# EAGLE design Daughter Board (EAGLE 9.1.3)
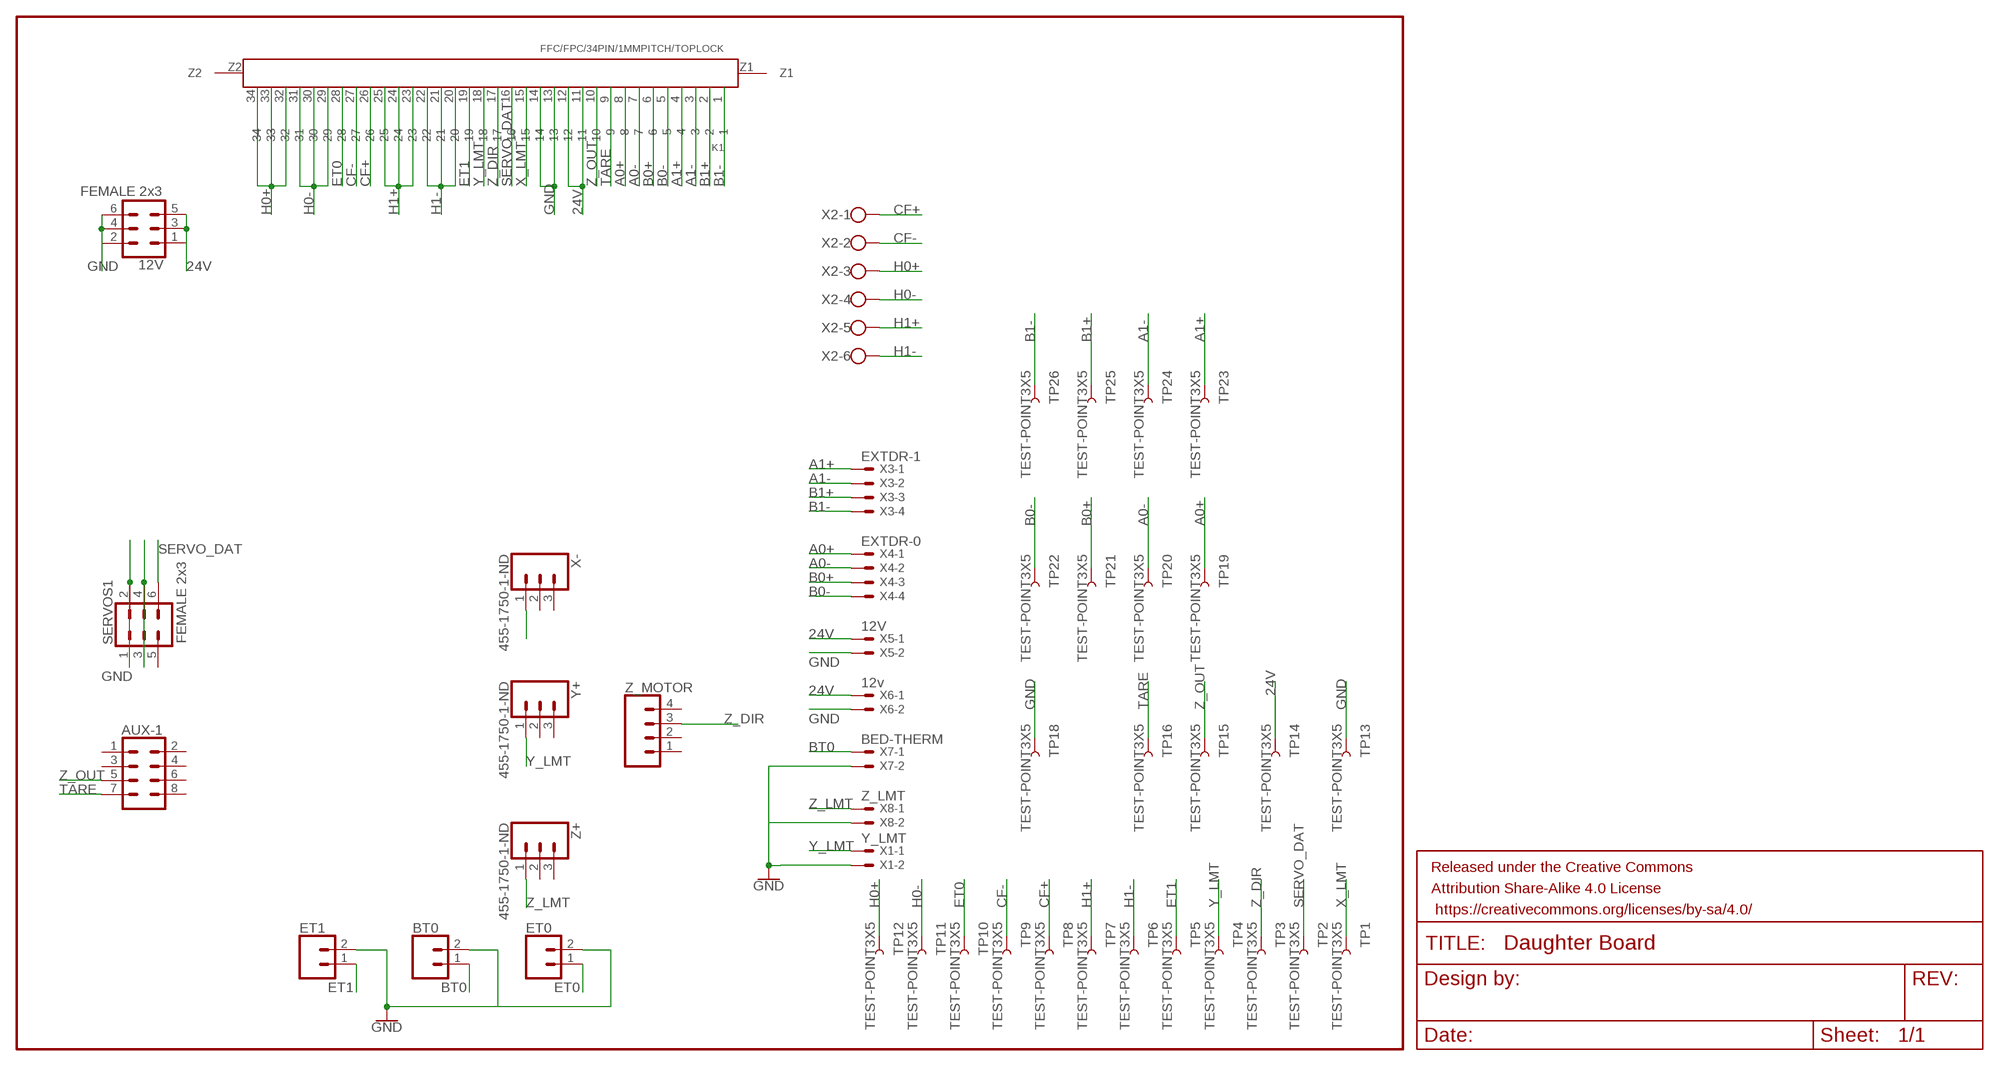
[diagram p0: schematic, sheet 1]

## Parts
12V  FEMALE 2x3  CONN_03X2FEMALE  [2X3]
AUX-1  CONN_04X2  [2X4]
BT0  CONN_02  [1X02]
ET0  CONN_02  [1X02]
ET1  CONN_02  [1X02]
FRAME1  FRAME-LETTERNO_PACKAGE  [DUMMY]
K1  FFC/FPC/34PIN/1MMPITCH/TOPLOCK  [34PIN/1MMPITCH/FFC/FPC]
SERVOS1  FEMALE 2x3  CONN_03X2FEMALE  [2X3]
TP1  TEST-POINT3X5  [PAD.03X.05]
TP2  TEST-POINT3X5  [PAD.03X.05]
TP3  TEST-POINT3X5  [PAD.03X.05]
TP4  TEST-POINT3X5  [PAD.03X.05]
TP5  TEST-POINT3X5  [PAD.03X.05]
TP6  TEST-POINT3X5  [PAD.03X.05]
TP7  TEST-POINT3X5  [PAD.03X.05]
TP8  TEST-POINT3X5  [PAD.03X.05]
TP9  TEST-POINT3X5  [PAD.03X.05]
TP10  TEST-POINT3X5  [PAD.03X.05]
TP11  TEST-POINT3X5  [PAD.03X.05]
TP12  TEST-POINT3X5  [PAD.03X.05]
TP13  TEST-POINT3X5  [PAD.03X.05]
TP14  TEST-POINT3X5  [PAD.03X.05]
TP15  TEST-POINT3X5  [PAD.03X.05]
TP16  TEST-POINT3X5  [PAD.03X.05]
TP18  TEST-POINT3X5  [PAD.03X.05]
TP19  TEST-POINT3X5  [PAD.03X.05]
TP20  TEST-POINT3X5  [PAD.03X.05]
TP21  TEST-POINT3X5  [PAD.03X.05]
TP22  TEST-POINT3X5  [PAD.03X.05]
TP23  TEST-POINT3X5  [PAD.03X.05]
TP24  TEST-POINT3X5  [PAD.03X.05]
TP25  TEST-POINT3X5  [PAD.03X.05]
TP26  TEST-POINT3X5  [PAD.03X.05]
X1  Y_LMT  JST-XH-02-PIN-LONG-PAD  [JST-XH-02-PACKAGE-LONG-PAD]
X2  W237-6  [W237-6]
X3  EXTDR-1  JST-XH-04-PIN-LONG-PAD  [JST-XH-04-PACKAGE-LONG-PAD]
X4  EXTDR-0  JST-XH-04-PIN-LONG-PAD  [JST-XH-04-PACKAGE-LONG-PAD]
X5  12V  JST-XH-02-PIN-LONG-PAD  [JST-XH-02-PACKAGE-LONG-PAD]
X6  12v  JST-XH-02-PIN-LONG-PAD  [JST-XH-02-PACKAGE-LONG-PAD]
X7  BED-THERM  JST-XH-02-PIN-LONG-PAD  [JST-XH-02-PACKAGE-LONG-PAD]
X8  Z_LMT  JST-XH-02-PIN-LONG-PAD  [JST-XH-02-PACKAGE-LONG-PAD]
X-  455-1750-1-ND  CONN_03  [1X03]
Y+  455-1750-1-ND  CONN_03  [1X03]
Z+  455-1750-1-ND  CONN_03  [1X03]
Z_MOTOR  CONN_04  [1X04]

## Nets
24V: 12V.1 12V.3 12V.5 K1.11 K1.12 TP14.P$1 X5.1 X6.1
A0+: K1.8 TP19.P$1 X4.1
A0-: K1.7 TP20.P$1 X4.2
A1+: K1.4 TP23.P$1 X3.1
A1-: K1.3 TP24.P$1 X3.2
B0+: K1.6 TP21.P$1 X4.3
B0-: K1.5 TP22.P$1 X4.4
B1+: K1.2 TP25.P$1 X3.3
B1-: K1.1 TP26.P$1 X3.4
BT0: BT0.1 X7.1
CF+: K1.26 TP8.P$1 X2.1
CF-: K1.27 TP9.P$1 X2.2
ET0: ET0.1 K1.28 TP10.P$1
ET1: ET1.1 K1.19 TP5.P$1
GND: 12V.2 12V.4 12V.6 BT0.2 ET0.2 ET1.2 K1.13 K1.14 SERVOS1.1 SERVOS1.2 TP13.P$1 TP18.P$1 X1.2 X5.2 X6.2 X7.2 X8.2
H0+: K1.32 K1.33 K1.34 TP12.P$1 X2.3
H0-: K1.29 K1.30 K1.31 TP11.P$1 X2.4
H1+: K1.23 K1.24 K1.25 TP7.P$1 X2.5
H1-: K1.20 K1.21 K1.22 TP6.P$1 X2.6
N$5: SERVOS1.3 SERVOS1.4
SERVO_DAT: K1.16 SERVOS1.6 TP2.P$1
TARE: AUX-1.7 K1.9 TP16.P$1
X_LMT: K1.15 TP1.P$1 X-.1
Y_LMT: K1.18 TP4.P$1 X1.1 Y+.1
Z_DIR: K1.17 TP3.P$1 Z_MOTOR.3
Z_LMT: X8.1 Z+.1
Z_OUT: AUX-1.5 K1.10 TP15.P$1
Unconnected: AUX-1.1 AUX-1.2 AUX-1.3 AUX-1.4 AUX-1.6 AUX-1.8 K1.Z1 K1.Z2 SERVOS1.5 X-.2 X-.3 Y+.2 Y+.3 Z+.2 Z+.3 Z_MOTOR.1 Z_MOTOR.2 Z_MOTOR.4

## Library data of the parts
12V SERVOS1 = SparkFun-Connectors:CONN_03X2: Multi connection point. Often used as Generic Header-pin footprint for 0.1 inch spaced/style header connections You can populate with any combo of single row headers, but if you'd like an exact match, check these: Header - 2x3 (Male, 0.1") <https://www.sparkfun.com/products/12807> (PRT-12807) Header - 2x3 (Female, 0.1") <https://www.sparkfun.com/products/13010> (PRT-13010) 2x3 Pin Shrouded Header <https://www.sparkfun.com/products/10877> (PRT-10877) On any of the 0.1 inch spaced packages, you can populate with these: Break Away Headers - Straight <https://www.sparkfun.com/products/116> (PRT-00116) Break Away Male Headers - Right Angle <https://www.sparkfun.com/products/553> (PRT-00553) Female Headers <https://www.sparkfun.com/products/115> (PRT-00115) Break Away Headers - Machine Pin <https://www.sparkfun.com/products/117> (PRT-00117) Break Away Female Headers - Swiss Machine Pin <https://www.sparkfun.com/products/743> (PRT-00743) Special note: the shrouded connector mates well with our 3x2 ribbon cables: Ribbon Crimp Connector - 6-pin (2x3, Female) <https://www.sparkfun.com/products/10651> (PRT-10651) Ribbon Cable - 6 wire (15ft) <https://www.sparkfun.com/products/10646> (PRT-10646); PROD_ID: CONN-11566
AUX-1 = SparkFun-Connectors:CONN_04X2: Multi connection point. Often used as Generic Header-pin footprint for 0.1 inch spaced/style header connections On any of the 0.1 inch spaced packages, you can populate with these: Break Away Headers - Straight <https://www.sparkfun.com/products/116> (PRT-00116) Break Away Male Headers - Right Angle <https://www.sparkfun.com/products/553> (PRT-00553) Female Headers <https://www.sparkfun.com/products/115> (PRT-00115) Break Away Headers - Machine Pin <https://www.sparkfun.com/products/117> (PRT-00117) Break Away Female Headers - Swiss Machine Pin <https://www.sparkfun.com/products/743> (PRT-00743)
BT0 ET0 ET1 = SparkFun-Connectors:CONN_02: Multi connection point. Often used as Generic Header-pin footprint for 0.1 inch spaced/style header connections On any of the 0.1 inch spaced packages, you can populate with these: Break Away Headers - Straight <https://www.sparkfun.com/products/116> (PRT-00116) Break Away Male Headers - Right Angle <https://www.sparkfun.com/products/553> (PRT-00553) Female Headers <https://www.sparkfun.com/products/115> (PRT-00115) Break Away Headers - Machine Pin <https://www.sparkfun.com/products/117> (PRT-00117) Break Away Female Headers - Swiss Machine Pin <https://www.sparkfun.com/products/743> (PRT-00743) For SCREWTERMINALS and SPRING TERMINALS visit here: Screw Terimnals on SparkFun.com <https://www.sparkfun.com/search/results?term=Screw+Terminals> (5mm/3.5mm/2.54mm spacing) This device is also useful as a general connection point to wire up your design to another part of your project. Our various solder wires solder well into these plated through hole pads. Hook-Up Wire - Assortment (Stranded, 22 AWG) <https://www.sparkfun.com/products/11375> (PRT-11375) Hook-Up Wire - Assortment (Solid Core, 22 AWG) <https://www.sparkfun.com/products/11367> (PRT-11367) View the entire wire category on our website here <https://www.sparkfun.com/categories/141> Special notes: Molex polarized connector foot print use with: PRT-08233 with associated crimp pins and housings. 2.54_SCREWTERM for use with PRT-10571. 3.5mm Screw Terminal footprints for PRT-08084 5mm Screw Terminal footprints for use with PRT-08432
FRAME1 = SparkFun-Aesthetics:FRAME-LETTER: Schematic Frame - Letter Standard 8.5x11 US Letter frame; DESIGNER: Nobody; VERSION: v01
K1 = FracktalWorks_Eagle_Library:FFC/FPC/34PIN/1MMPITCH/TOPLOCK
TP1-TP16 TP18-TP26 = SparkFun-Connectors:TEST-POINT: SparkFun Test Points Bare copper test points for troubleshooting or In-Circuit-Testing. These are used by our Production team for verifying production board runs using pogo-pins on test beds. SparkFun Products: SparkFun LSM9DS1 Breakout <https://www.sparkfun.com/products/13284> SparkFun PSOC <https://www.sparkfun.com/products/13714> SparkFun Load Cell Amplifier <https://www.sparkfun.com/products/13879>
X1 X5-X8 = Rembrandt Electronics - JST XH Connectors v1-0:JST-XH-02-PIN: JST XH Connector 2 Pin Wire to board connector. Pitch: 2,54 mm, (0.100") Number of pins: 2 Created by Rembrandt Electronics www.rembrandtelectronics.com
X2 = con-wago-500:W237-6: WAGO SCREW CLAMP; OC_FARNELL: unknown; OC_NEWARK: unknown
X3 X4 = Rembrandt Electronics - JST XH Connectors v1-0:JST-XH-04-PIN: JST XH Connector 2 Pin Wire to board connector. Pitch: 2,54 mm, (0.100") Number of pins: 4 Created by Rembrandt Electronics www.rembrandtelectronics.com
X- Y+ Z+ = SparkFun-Connectors:CONN_03: Multi connection point. Often used as Generic Header-pin footprint for 0.1 inch spaced/style header connections On any of the 0.1 inch spaced packages, you can populate with these: Break Away Headers - Straight <https://www.sparkfun.com/products/116> (PRT-00116) Break Away Male Headers - Right Angle <https://www.sparkfun.com/products/553> (PRT-00553) Female Headers <https://www.sparkfun.com/products/115> (PRT-00115) Break Away Headers - Machine Pin <https://www.sparkfun.com/products/117> (PRT-00117) Break Away Female Headers - Swiss Machine Pin <https://www.sparkfun.com/products/743> (PRT-00743) Stackable Header - 3 Pin (Female, 0.1") <https://www.sparkfun.com/products/13875> (PRT-13875) For SCREWTERMINALS and SPRING TERMINALS visit here: Screw Terimnals on SparkFun.com <https://www.sparkfun.com/search/results?term=Screw+Terminals> (5mm/3.5mm/2.54mm spacing) This device is also useful as a general connection point to wire up your design to another part of your project. Our various solder wires solder well into these plated through hole pads. Hook-Up Wire - Assortment (Stranded, 22 AWG) <https://www.sparkfun.com/products/11375> (PRT-11375) Hook-Up Wire - Assortment (Solid Core, 22 AWG) <https://www.sparkfun.com/products/11367> (PRT-11367) View the entire wire category on our website here <https://www.sparkfun.com/categories/141> Special notes: Molex polarized connector foot print use with SKU : PRT-08232 with associated crimp pins and housings.; PROD_ID: XXX-00000
Z_MOTOR = SparkFun-Connectors:CONN_04: Multi connection point. Often used as Generic Header-pin footprint for 0.1 inch spaced/style header connections On any of the 0.1 inch spaced packages, you can populate with these: Break Away Headers - Straight <https://www.sparkfun.com/products/116> (PRT-00116) Break Away Male Headers - Right Angle <https://www.sparkfun.com/products/553> (PRT-00553) Female Headers <https://www.sparkfun.com/products/115> (PRT-00115) Break Away Headers - Machine Pin <https://www.sparkfun.com/products/117> (PRT-00117) Break Away Female Headers - Swiss Machine Pin <https://www.sparkfun.com/products/743> (PRT-00743) For SCREWTERMINALS and SPRING TERMINALS visit here: Screw Terimnals on SparkFun.com <https://www.sparkfun.com/search/results?term=Screw+Terminals> (5mm/3.5mm/2.54mm spacing) This device is also useful as a general connection point to wire up your design to another part of your project. Our various solder wires solder well into these plated through hole pads. Hook-Up Wire - Assortment (Stranded, 22 AWG) <https://www.sparkfun.com/products/11375> (PRT-11375) Hook-Up Wire - Assortment (Solid Core, 22 AWG) <https://www.sparkfun.com/products/11367> (PRT-11367) View the entire wire category on our website here <https://www.sparkfun.com/categories/141> Special notes: Molex polarized connector foot print use with SKU : PRT-08231 with associated crimp pins and housings. 1MM SMD Version SKU: PRT-10208; PROD_ID: CONN-09696

## Board
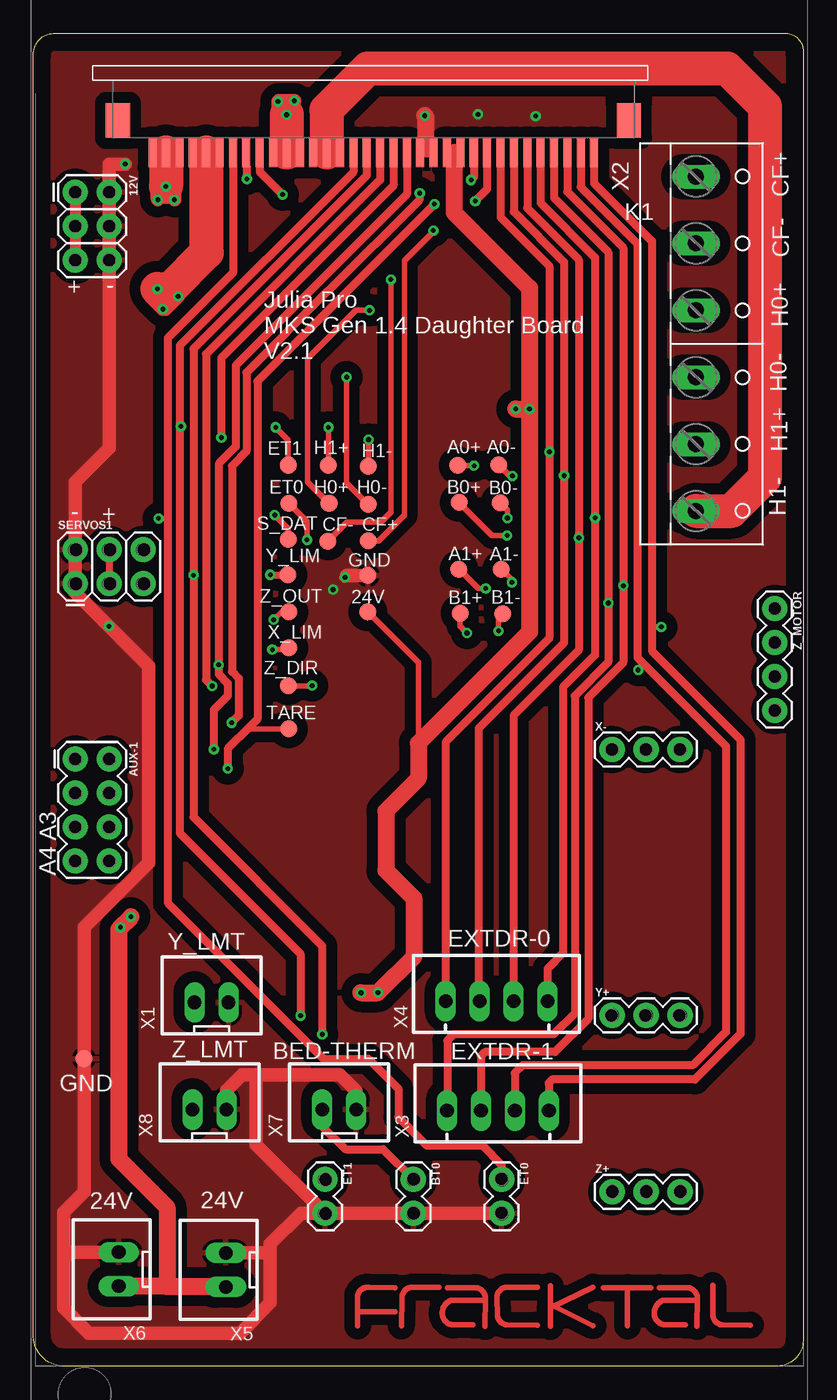
[diagram p1: board, top side]
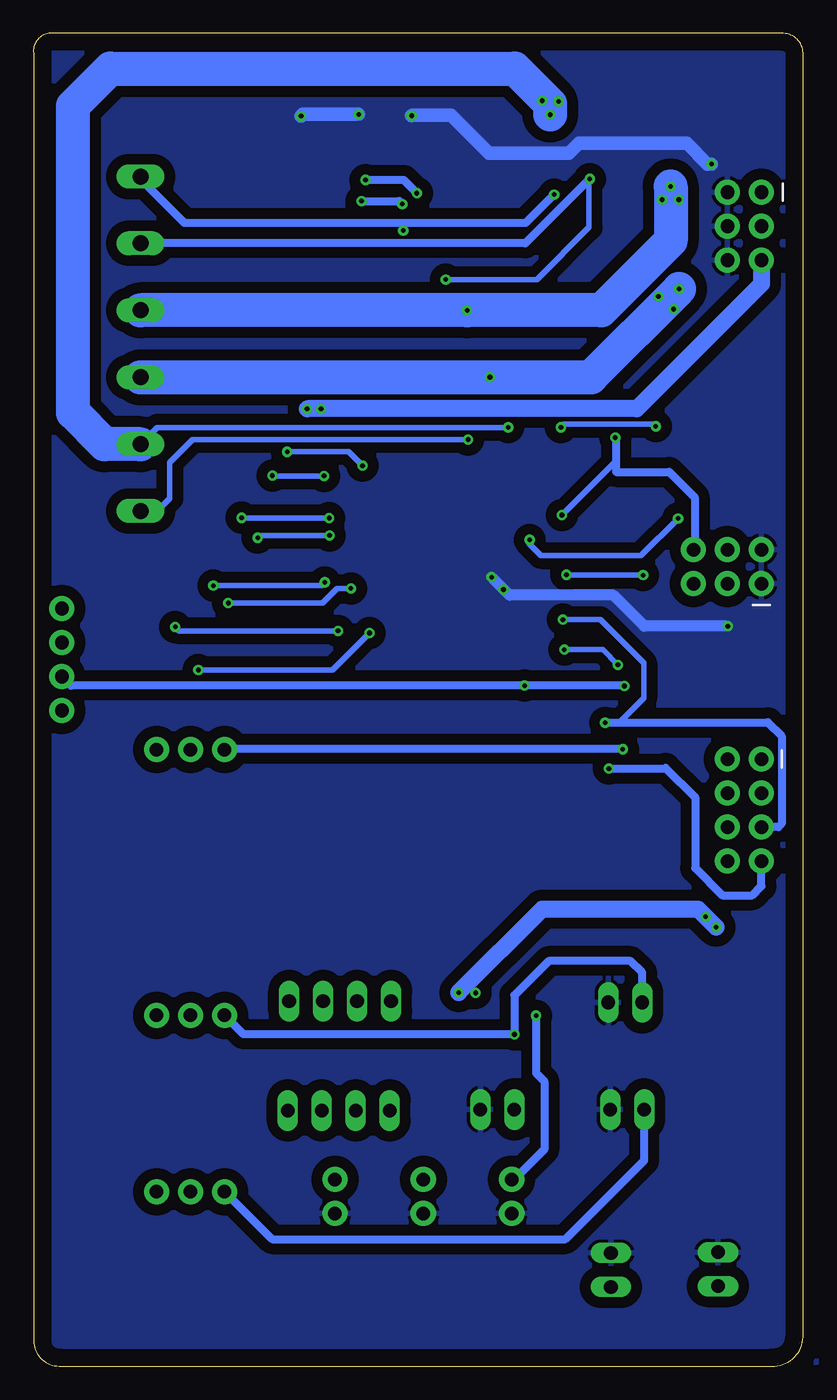
[diagram p2: board, bottom side, seen from below]

Size 57.54 x 99.59 mm. Coordinates in mm from the lower left corner, seen from the top.
Outline: 57.53,98.12 57.53,1.9 arc-90 55.63,0 2.34,0 arc-90 0,2.18 0,97.99 arc-90 1.47,99.59 56.39,99.59 arc-90 57.53,98.12
Copper layers (1*16): Top 0.035mm / dielectric 1.5mm / Bottom 0.035mm
Design rules "LionCircuits": minimum track width 8mil, minimum drill 0.35mm, track to track 8mil, track to pad 8mil, pad to pad 8mil, via to via 8mil, smd to smd 8mil, copper to edge 50mil, drill to drill 10mil, minimum pad ring 10mil, minimum via ring 8mil, stop-mask expansion 4mil, vias tented up to drill 0mil, thermal gap 10mil

### Footprints (pad centres in the part's own frame; a part is rotated, then mirrored left to right if it is on the bottom)
2X3 = drill 1.016 pad 1.88: 1 0,0; 2 0,2.54; 3 2.54,0; 4 2.54,2.54; 5 5.08,0; 6 5.08,2.54
2X4 = drill 1.016 pad 1.88: 1 -3.81,-1.27; 2 -3.81,1.27; 3 -1.27,-1.27; 4 -1.27,1.27; 5 1.27,-1.27; 6 1.27,1.27; 7 3.81,-1.27; 8 3.81,1.27
1X02 = drill 1.016 pad 1.88: 1 0,0; 2 2.54,0
34PIN/1MMPITCH/FFC/FPC = smd 0.6 x 2.2: 1 -14.43,2.1; 2 -13.43,2.1; 3 -12.43,2.1; 4 -11.43,2.1; 5 -10.43,2.1; 6 -9.43,2.1; 7 -8.43,2.1; 8 -7.43,2.1; 9 -6.43,2.1; 10 -5.43,2.1; 11 -4.43,2.1; 12 -3.43,2.1; 13 -2.43,2.1; 14 -1.43,2.1; 15 -0.43,2.1; 16 0.57,2.1; 17 1.57,2.1; 18 2.57,2.1; 19 3.57,2.1; 20 4.57,2.1; 21 5.57,2.1; 22 6.57,2.1; 23 7.57,2.1; 24 8.57,2.1; 25 9.57,2.1; 26 10.57,2.1; 27 11.57,2.1; 28 12.57,2.1; 29 13.57,2.1; 30 14.57,2.1; 31 15.57,2.1; 32 16.57,2.1; 33 17.57,2.1; 34 18.57,2.1 | smd 1.8 x 2.6: Z1 -17.03,-0.3; Z2 21.17,-0.3
PAD.03X.05 = smd 1.27 x 1.27: P$1 0,0
JST-XH-02-PACKAGE-LONG-PAD = drill 1.016 long: 1 -1.27,0; 2 1.27,0
W237-6 = drill 1.194 long: 1 -12.5,-1.27; 2 -7.5,-1.27; 3 -2.5,-1.27; 4 2.5,-1.27; 5 7.5,-1.27; 6 12.5,-1.27
JST-XH-04-PACKAGE-LONG-PAD = drill 1.016 long: 1 -3.81,0; 2 -1.27,0; 3 1.27,0; 4 3.81,0
1X03 = drill 1.016 pad 1.88: 1 0,0; 2 2.54,0; 3 5.08,0
1X04 = drill 1.016 pad 1.88: 1 0,0; 2 2.54,0; 3 5.08,0; 4 7.62,0

### Placement (x,y rotation side)
12V  3.12,87.73 270 top
AUX-1  4.39,41.55 270 top
BT0  28.4,13.94 270 top
ET0  35,13.94 270 top
ET1  21.79,13.94 270 top
FRAME1  30.81,190.86 270 top  (outside the outline)
K1  27.48,92.79 180 top
SERVOS1  3.12,58.47 0 top
TP1  19.1,53.67 0 top
TP2  19.05,61.8 0 top
TP3  19.05,50.83 0 top
TP4  19.02,59.13 0 top
TP5  19.05,67.34 0 top
TP6  25.04,67.26 0 top
TP7  22.05,67.31 0 top
TP8  25.02,61.67 0 top
TP9  22.02,61.65 0 top
TP10  19.08,64.49 0 top
TP11  25.02,64.39 0 top
TP12  22.1,64.47 0 top
TP13  3.78,22.96 180 top
TP14  24.99,56.36 180 top
TP15  19.1,56.36 180 top
TP16  19.08,47.62 180 top
TP18  24.99,59.08 180 top
TP19  31.72,67.31 180 top
TP20  34.77,67.36 180 top
TP21  31.83,64.54 180 top
TP22  34.87,64.52 180 top
TP23  31.8,59.56 0 top
TP24  34.98,59.54 0 top
TP25  31.9,56.26 0 top
TP26  35.08,56.24 0 top
U$1  [FRACKTALLOGO]  36.22,2.9 0 top
X1  13.31,27.18 0 top
X2  50.8,76.4 270 top
X3  34.72,19.1 0 top
X4  34.62,27.28 0 top
X5  14.38,7.19 90 top
X6  6.38,7.24 90 top
X7  22.86,19.18 0 top
X8  13.16,19.18 0 top
X-  43.26,46.08 0 top
Y+  43.26,26.21 0 top
Z+  43.26,13.03 0 top
Z_MOTOR  55.42,56.62 270 top

### Tracks (layer width: path | path; a pad name or v marks a point on that pad's centre or on a via)
24V  (via drill 0.35)
  Top 0.406: 28.78,46.56 28.78,52.58 TP14.P$1
  Top 0.508: K1.12 31.45,90.69 K1.11
  Top 0.813: 12V.1 12V.3 12V.5
  Top 1.27: v7.29,33.58 6.38,32.66 6.38,15.47 9.98,11.86 9.98,5.94 | v24.49,27.89 25.73,27.89 v25.76,27.91 28.43,30.59 28.43,34.96 26.34,37.06 26.34,41.48 28.78,43.92 28.78,46.56 37.08,54.86 v37.08,71.53 | 31.45,90.69 31.45,86.21 37.08,80.57 v37.08,71.53 | v36.04,71.53 v37.08,71.53 | 9.98,5.94 14.35,5.94 X5.1 | X6.1 6.4,5.94 9.98,5.94
  Bottom 1.27: 12V.5 3.12,80.87 12.45,71.55 37.06,71.55 v37.08,71.53 | v6.5,32.79 v7.29,33.58 7.87,34.16 19.51,34.16 v25.76,27.91
A0+  (via drill 0.35)
  Top 0.406: v32.94,67.28 31.75,67.28 TP19.P$1
  Top 0.61: X4.1 30.81,46.63 38.57,54.39 v38.57,68.33 38.57,82.2 34.91,85.86 K1.8
  Bottom 0.406: v32.94,67.28 33.99,68.33 v38.57,68.33
A0-  (via drill 0.35)
  Top 0.406: TP20.P$1 35.61,66.52 v35.81,66.52
  Top 0.61: X4.2 33.27,27.36 33.27,47.65 39.67,54.05 v39.67,66.55 39.67,82.51 35.91,86.27 K1.7
  Bottom 0.406: v35.81,66.52 36.37,66.52 39.65,66.52 v39.67,66.55
A1+  (via drill 0.35)
  Top 0.406: TP23.P$1 33.25,58.12 v33.81,58.12
  Top 0.61: X3.1 30.94,19.13 30.94,24.33 31.39,24.79 38.89,24.79 40.46,26.37 40.46,50.1 42.98,52.61 v42.98,57.02 42.98,83.24 38.91,87.31 K1.4
  Bottom 0.406: v33.81,58.12 34.85,58.12 35.94,57.02 v42.98,57.02
A1-  (via drill 0.35)
  Top 0.406: v35.76,58.57 35.76,58.78 35,59.54 TP24.P$1
  Top 0.61: X3.2 33.45,23.16 33.76,23.47 38.99,23.47 41.48,25.96 41.48,49.96 44.09,52.58 v44.09,58.32 44.09,83.57 39.9,87.76 39.9,90.68 K1.3
  Bottom 0.406: v35.76,58.57 36.02,58.32 v44.09,58.32
B0+  (via drill 0.35)
  Top 0.406: TP21.P$1 34.29,62.08 v35.41,62.08
  Top 0.61: X4.3 35.89,48.62 40.77,53.5 v40.77,61.9 40.77,82.69 36.91,86.55 K1.6
  Bottom 0.406: v35.41,62.08 40.6,62.08 v40.77,61.9
B0-  (via drill 0.35)
  Top 0.406: TP22.P$1 35.43,63.96 v35.43,63.37
  Top 0.61: K1.5 37.91,86.93 41.99,82.85 v41.99,63.4 41.99,53.14 39.6,50.75 39.6,30.86 38.43,29.69 X4.4
  Bottom 0.406: v35.43,63.37 41.96,63.37 v41.99,63.4
B1+  (via drill 0.35)
  Top 0.406: TP25.P$1 31.9,55.3 v32.41,54.79 | v45.21,52.02 45.64,52.45
  Top 0.61: X3.3 35.99,21.89 36.58,22.48 49.28,22.48 51.77,24.97 51.77,46.33 45.64,52.45 45.15,52.94 45.15,83.88 40.91,88.12 K1.2
  Bottom 0.406: v32.41,54.79 35.18,52.02 v45.21,52.02
B1-  (via drill 0.35)
  Top 0.406: TP26.P$1 34.77,55.93 v34.77,54.94 | v46.94,55.24 46.26,55.24 46.23,55.27
  Top 0.61: X3.4 38.53,21.11 38.51,21.13 38.79,21.41 49.45,21.41 52.86,24.82 52.86,46.81 46.23,53.44 46.23,55.27 46.23,84.08 41.91,88.4 K1.1
  Bottom 0.406: v34.77,54.94 46.63,54.94 v46.94,55.24
BT0
  Top 0.61: X7.1 21.59,17.93 23.32,16.21 26.14,16.21 BT0.1
CF+  (via drill 0.35)
  Top 0.406: TP8.P$1 25.81,61.67 27.74,63.6 27.74,82.63 29.9,84.79 v29.9,84.87
  Top 0.61: K1.26 16.91,89.26 v18.62,87.55
  Bottom 0.406: v29.9,84.87 29.9,85.37 29.84,85.42
  Bottom 0.61: v18.62,87.55 20.75,85.42 29.84,85.42 46.25,85.42 49.53,88.7 X2.1
CF-  (via drill 0.35)
  Top 0.406: TP9.P$1 23.44,63.07 25.98,63.07 26.72,63.8 v26.72,81.2
  Top 0.61: K1.27 v15.95,88.72
  Bottom 0.406: v26.72,81.2 19.91,81.2 16,85.12 16,88.67 v15.95,88.72
  Bottom 0.61: v15.95,88.72 20.77,83.9 X2.2
ET0  (via drill 0.35)
  Top 0.406: TP10.P$1 20.45,63.12 v20.45,61.75 | v9.35,63.35 10.03,63.35
  Top 0.61: ET0.1 35,15.04 33.55,16.48 29.39,16.48 27.28,18.59 27.28,20.73 25.04,22.96 21.69,22.96 10.03,34.62 10.03,63.35 10.03,76.83 14.91,81.71 K1.28
  Bottom 0.406: v9.35,63.35 12.12,60.58 19.61,60.58 20.45,61.42 v20.45,61.75
ET1  (via drill 0.35)
  Top 0.406: TP5.P$1 19.05,69.21 v18.11,70.15
  Top 0.508: v11.02,70.23 10.95,70.15
  Top 0.61: K1.19 23.91,89.24 10.95,76.28 10.95,70.23 v11.02,70.23 | 10.95,70.15 10.95,39.83 19.96,30.81 v19.96,26.19
  Bottom 0.406: v18.11,70.15 17.88,70.38 11.18,70.38 v11.02,70.23
  Bottom 0.61: v19.96,26.19 19.96,21.89 19.35,21.29 19.35,16.18 21.59,13.94 ET1.1
GND  (via drill 0.35)
  Top 0.508: K1.13 29.79,90.57 29.03,90.57 K1.14 29.23,91.01 29.34,91.01
  Top 0.813: SERVOS1.1 3.12,57.81 | v23.29,58.95 23.42,59.08
  Top 1.016: v6.86,89.84 5.66,89.84 12V.2 12V.4 12V.6 5.66,68.61 3.12,66.07 SERVOS1.2 SERVOS1.1 | 3.12,57.81 v5.64,55.3 8.61,52.32 8.61,37.59 3.78,32.77 TP13.P$1 3.78,13.03 2.26,11.51 2.26,7.98 | 23.42,59.08 TP18.P$1 | ET1.2 BT0.2 ET0.2 | X7.2 24.13,20.57 22.94,21.77 16.66,21.77 | 16.66,21.77 15.6,21.77 14.43,20.6 X8.2 | 16.66,21.77 16.66,16.54 ET1.2 | 2.26,7.98 2.26,4.34 4.14,2.46 15.44,2.46 17.7,4.72 17.7,8.43 | 17.7,8.43 17.7,9.12 19.99,11.4 ET1.2 | 2.26,7.98 2.79,8.51 X6.2 | 17.7,8.43 17.68,8.46 X5.2
  Top 1.27: v29.26,93.45 29.34,93.37 29.34,91.01
  Bottom 0.813: v5.64,55.3 11.89,55.3 14.2,57.61 21.95,57.61 v23.29,58.95
  Bottom 1.016: v6.86,89.84 7.16,89.84 8.71,91.39 16.76,91.39 17.5,90.65 23.49,90.65 26.34,93.5 29.21,93.5 v29.26,93.45 | v37.54,93.42 37.41,93.55 v33.22,93.55
  other vias: 22.4,58.04
  pour Top (isolate 0.813): 0.23,99.31 57.48,99.31 57.48,93.9 57.48,0.15 0.18,0.15 0.18,99.34 0.23,99.34
  pour Bottom (isolate 0.813): -0.99,99.42 -0.99,0.23 57.51,0.23 57.51,99.42
H0+  (via drill 0.35)
  Top 0.406: TP12.P$1 20.5,66.07 20.5,75.29 24.12,78.9 v25.12,78.9
  Top 0.508: v9.91,88.16 9.04,88.16 9.04,87.17 v9.3,87.17 9.91,87.78 v9.91,88.16 | v9.91,88.16 v9.91,88.17
  Top 0.61: K1.34 K1.33 K1.32
  Top 1.016: v9.91,88.17 10.54,87.54 v10.54,87.17 10.36,87.35 9.47,87.35 v9.3,87.17
  Top 2.54: K1.33 v9.91,88.17
  Bottom 2.54: X2.3 v25.12,78.9 15.1,78.9 9.91,84.1 v9.91,88.16
H0-  (via drill 0.35)
  Top 0.406: TP11.P$1 23.42,65.99 v23.42,73.9
  Top 0.61: K1.31 K1.30 | K1.29 13.87,90.64 12.95,90.64
  Top 1.016: v10.82,79.93 10.26,80.49 v9.27,80.49 8.81,80.04 8.81,79.86 v9.68,78.99 9.88,78.99 v10.82,79.93
  Top 2.54: v9.27,80.49 10.21,80.49 12.95,83.24 12.95,90.64 K1.30
  Bottom 2.54: X2.4 v23.42,73.9 15.86,73.9 v9.27,80.49
H1+  (via drill 0.35)
  Top 0.406: TP7.P$1 v22.05,70.15
  Top 0.61: K1.25 K1.24 | K1.24 K1.23
  Top 1.016: v19.51,94.56 18.34,94.56 v18.29,94.51 18.29,94.16 v18.92,93.52
  Top 2.54: v18.92,93.52 K1.24
  Bottom 0.406: v22.05,70.15 48.28,70.15 X2.5
  Bottom 2.54: X2.5 52.24,68.9 54.58,71.25 54.58,94.18 51.8,96.96 21.55,96.96 18.92,94.34 v18.92,93.52
H1-  (via drill 0.35)
  Top 0.406: TP6.P$1 v25.04,69.24
  Top 0.61: K1.20 K1.21 K1.22
  Top 2.54: K1.21 21.91,93.86 21.89,93.88 24.98,96.96 51.85,96.96 54.7,94.12 54.7,66.43 52.17,63.9 X2.6
  Bottom 0.406: v25.04,69.24 45.64,69.24 47.35,67.54 47.35,64.85 48.29,63.9 X2.6
N$5
  Top 0.508: SERVOS1.4 SERVOS1.3
SERVO_DAT  (via drill 0.35)
  Top 0.406: v18.03,63.6 19.05,62.59 TP2.P$1
  Top 0.61: K1.16 26.91,88.2 14.05,75.34 v14.05,69.39
  Bottom 0.406: v18.03,63.6 14,67.64
  Bottom 0.61: SERVOS1.6 8.1,61.11 8.1,64.92 10.01,66.83 14,66.83 14,66.85 14,67.64 14,69.34 v14.05,69.39
TARE  (via drill 0.35)
  Top 0.406: TP16.P$1 16.28,47.62 16.15,47.76
  Top 0.61: K1.9 33.91,87.96 v33.02,87.07 | v29.97,86.84 16.74,73.61 16.74,48.35 16.15,47.76 14.53,46.14 v14.53,44.65
  Bottom 0.61: v33.02,87.07 30.2,87.07 v29.97,86.84 | AUX-1.7 3.12,35.86 3.81,35.18 6.05,35.18 8.08,37.21 8.08,42.49 10.29,44.7 10.34,44.65 v14.53,44.65
X_LMT  (via drill 0.35)
  Top 0.406: TP1.P$1 18.97,53.54 v17.86,53.54
  Top 0.61: K1.15 27.91,87.58 15.11,74.78 15.11,68.71 13.84,67.44 v13.84,52.4 | v13.49,46.1 13.49,49.05 14.53,50.09 14.53,51.03 13.84,51.71 v13.84,52.4 | v13.84,52.4 v13.85,52.4
  Bottom 0.406: v17.86,53.54 14.99,53.54 v13.85,52.4
  Bottom 0.61: v13.49,46.1 43.23,46.1 X-.1
Y_LMT  (via drill 0.35)
  Top 0.508: v17.7,59.13 TP4.P$1
  Top 0.61: K1.18 24.91,88.97 11.96,76.02 v11.96,59.11 11.96,41.02 21.59,31.39 v21.59,24.79
  Bottom 0.406: v17.7,59.13 11.99,59.13 v11.96,59.11
  Bottom 0.61: Y+.1 41.83,24.79 v21.59,24.79 21.59,27.71 19.02,30.28 12.9,30.28 12.04,29.41 X1.1
Z_DIR  (via drill 0.35)
  Top 0.406: TP3.P$1 20.8,50.83 v20.83,50.85
  Top 0.61: K1.17 25.91,88.65 12.9,75.64 12.9,51.28 v13.36,50.83
  Bottom 0.61: Z_MOTOR.3 54.74,50.85 v20.83,50.85 13.41,50.85 13.39,50.83 v13.36,50.83
Z_LMT
  Bottom 0.61: Z+.1 39.7,9.47 17.78,9.47 11.89,15.37 X8.1
Z_OUT  (via drill 0.35)
  Top 0.406: TP15.P$1 18.54,56.36 v17.96,55.78
  Top 0.61: K1.10 32.91,88.84 v32.72,88.65 | v28.88,87.66 28.85,87.63 28.85,87.14 22.08,80.37 22.03,80.37 15.93,74.26 15.93,68.37 14.83,67.28 14.83,51.9 15.34,51.39 15.34,48.62 v14.81,48.08
  Bottom 0.406: v17.96,55.78 15.16,55.78 11.91,52.53 11.91,49.91 13.74,48.08 v14.81,48.08
  Bottom 0.61: v32.72,88.65 29.87,88.65 v28.88,87.66 | AUX-1.5 1.85,40.28 1.61,40.53 1.61,47.08 2.64,48.11 2.67,48.08 v14.81,48.08

### Text on the board
tPlace: CF+ | CF- | H0+ | + | - | H0- | Julia Pro / MKS Gen 1.4 Daughter Board / V2.1 | H1+ | ET1 | H1+ | H1- | A0+ | A0- | H1- | ET0 | H0+ | H0- | B0+ | B0- | - | + | S_DAT | CF- | CF+ | Y_LIM | GND | A1+ | A1- | Z_OUT | 24V | B1+ | B1- | X_LIM | Z_DIR | TARE | A3 | A4 | EXTDR-0 | Z_LMT | BED-THERM | EXTDR-1 | GND | 24V | 24V
tNames: Y_LMT